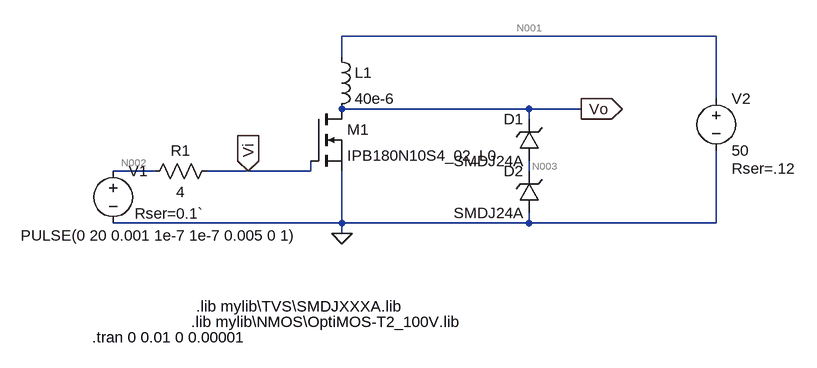
[diagram p0: schematic TVS Diode Config.asc]
TVS Diode Config.asc, the LTspice schematic file:
Version 4
SHEET 1 916 680
WIRE 688 -16 112 -16
WIRE 112 16 112 -16
WIRE 688 80 688 -16
WIRE 400 96 112 96
WIRE 480 96 400 96
WIRE 400 112 400 96
WIRE -176 192 -240 192
WIRE -32 192 -96 192
WIRE 64 192 64 176
WIRE 64 192 -32 192
WIRE 400 192 400 176
WIRE 112 272 112 192
WIRE 112 272 -240 272
WIRE 400 272 400 256
WIRE 400 272 112 272
WIRE 688 272 688 160
WIRE 688 272 400 272
WIRE 112 288 112 272
FLAG 112 288 0
FLAG 480 96 Vo
IOPIN 480 96 Out
FLAG -32 192 Vi
IOPIN -32 192 In
SYMBOL nmos 64 96 R0
SYMATTR InstName M1
SYMATTR Value IPB180N10S4_02_L0
SYMATTR Prefix X
SYMBOL voltage -240 176 R0
WINDOW 3 -142 115 Left 2
WINDOW 123 24 124 Left 2
WINDOW 39 33 81 Left 2
SYMATTR Value PULSE(0 20 0.001 1e-7 1e-7 0.005 0 1)
SYMATTR SpiceLine Rser=0.1`
SYMATTR InstName V1
SYMBOL voltage 688 64 R0
WINDOW 123 0 0 Left 0
WINDOW 39 24 124 Left 2
SYMATTR SpiceLine Rser=.12
SYMATTR InstName V2
SYMATTR Value 50
SYMBOL ind 96 0 R0
SYMATTR InstName L1
SYMATTR Value 40e-6
SYMATTR SpiceLine Rser=.08 Cpar=1e-9
SYMBOL res -80 176 R90
WINDOW 0 0 56 VBottom 2
WINDOW 3 32 56 VTop 2
SYMATTR InstName R1
SYMATTR Value 4
SYMBOL zener 416 176 R180
WINDOW 0 24 64 Left 2
WINDOW 3 24 0 Left 2
SYMATTR InstName D1
SYMATTR Value SMDJ24A
SYMATTR Prefix X
SYMBOL zener 416 256 R180
WINDOW 0 24 64 Left 2
WINDOW 3 24 0 Left 2
SYMATTR InstName D2
SYMATTR Value SMDJ24A
SYMATTR Prefix X
TEXT -120 424 Left 2 !.lib mylib\\NMOS\\OptiMOS-T2_100V.lib
TEXT -272 448 Left 2 !.tran 0 0.01 0 0.00001
TEXT -112 400 Left 2 !.lib mylib\\TVS\\SMDJXXXA.lib

The netlist it stands for:
* TVS Diode Config.asc
XM1 Vo Vi 0 IPB180N10S4_02_L0  ; pins D G S
V1 N002 0 PULSE(0 20 0.001 1e-7 1e-7 0.005 0 1) Rser=0.1`
V2 N001 0 50 Rser=.12
L1 N001 Vo 40e-6 Rser=.08 Cpar=1e-9
R1 Vi N002 4
XD1 N003 Vo SMDJ24A  ; pins + -
XD2 0 N003 SMDJ24A  ; pins + -
.lib mylib\NMOS\OptiMOS-T2_100V.lib
.tran 0 0.01 0 0.00001
.lib mylib\TVS\SMDJXXXA.lib
.backanno
.end

* Results of the author's LTspice run, read from the files saved beside the schematic
* Operating Point, zero values left out:
*   V(vi) = 20.5 µV
*   V(vo) = 50 V
*   V(n002) = 500 nV
*   V(n001) = 50 V
*   V(n003) = 25 V
*   I(L1) = 16.04 µA
*   I(R1) = 5 µA
*   I(V2) = -16.04 µA
*   I(V1) = 5 µA
*   Ix(m1:DRAIN) = 5.001 µA
*   Ix(m1:GATE) = -5 µA
*   Ix(m1:SOURCE) = -716.8 pA
*   Ix(d1:1) = -11.04 µA
*   Ix(d1:2) = 11.04 µA
*   Ix(d2:1) = -11.04 µA
*   Ix(d2:2) = 11.04 µA
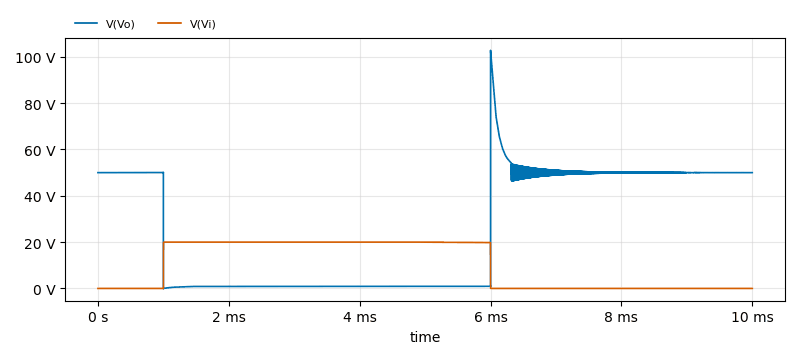
[diagram p1: Transient Analysis of TVS Diode Config.asc, plotted from the saved traces]
* Transient Analysis, 1 run:
*   V(Vo): min -159 mV, max 102.9 V, average 26.01 V, rms 36.36 V, last 50 V
*   V(Vi): min -5.534 mV, max 20 V, average 10 V, rms 14.14 V, last 18.6 µV